# EAGLE design RasPi-BplusHAT (EAGLE 8.6.3)
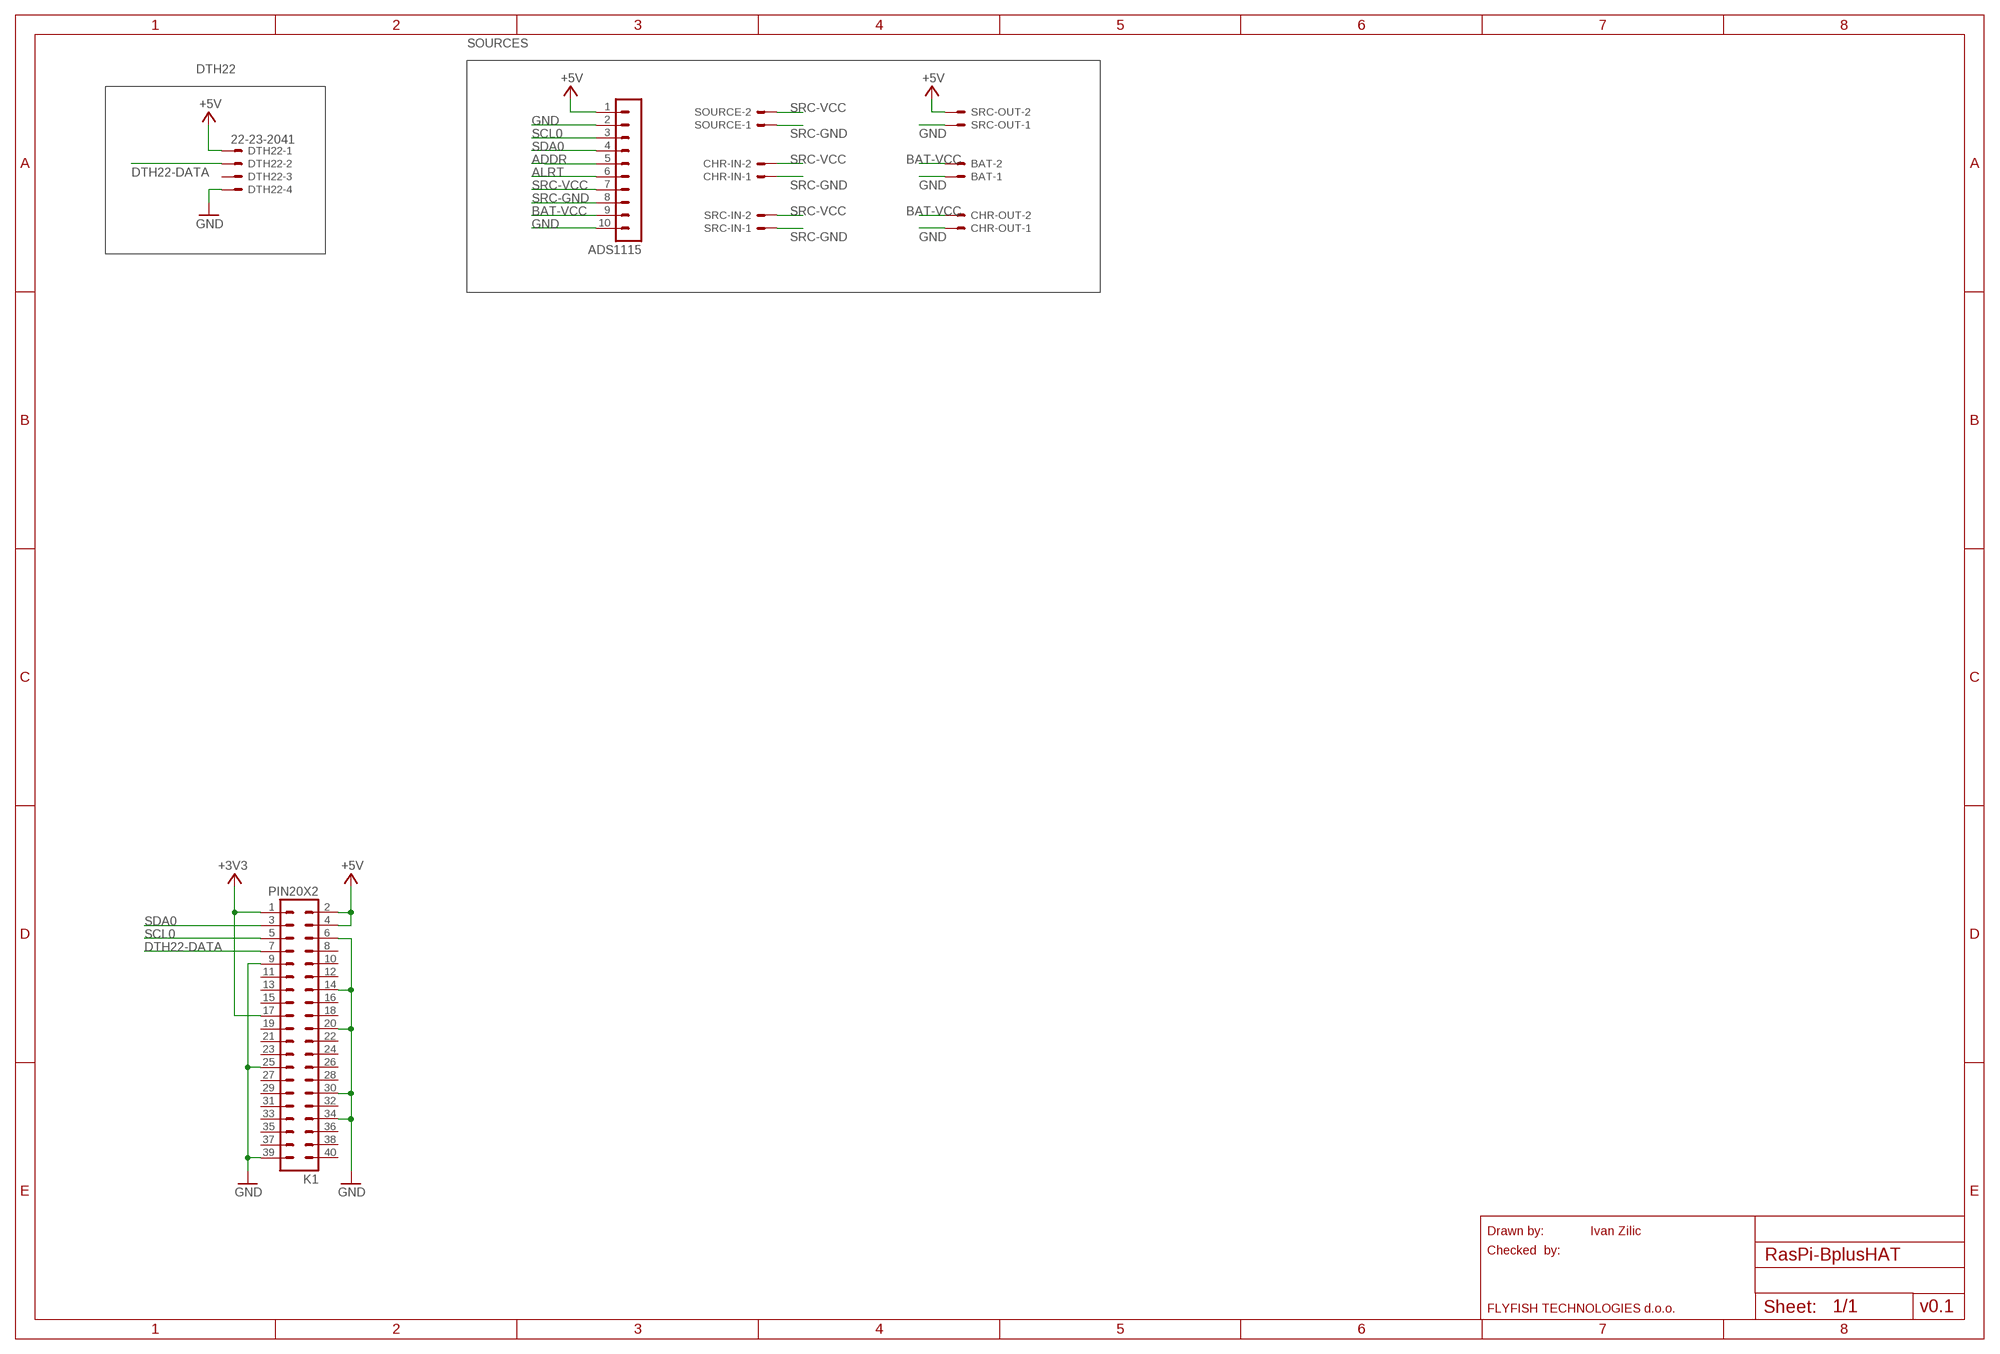
[diagram p0: schematic, sheet 1]

## Parts
ADS1115  MA10-1  [MA10-1]
BAT  22-23-2021  [22-23-2021]
CHR-IN  22-23-2021  [22-23-2021]
CHR-OUT  22-23-2021  [22-23-2021]
DTH22  22-23-2041  [22-23-2041]
K1  PIN20X2  [PIN_20X2]
SOURCE  22-23-2021  [22-23-2021]
SRC-IN  22-23-2021  [22-23-2021]
SRC-OUT  22-23-2021  [22-23-2021]

## Nets
+3V3: K1.1 K1.17
+5V: ADS1115.1 DTH22.1 K1.2 K1.4 SRC-OUT.2
ADDR: ADS1115.5
ALRT: ADS1115.6
BAT-VCC: ADS1115.9 BAT.2 CHR-OUT.2
DTH22-DATA: DTH22.2 K1.7
GND: ADS1115.2 ADS1115.10 BAT.1 CHR-OUT.1 DTH22.4 K1.6 K1.9 K1.14 K1.20 K1.25 K1.30 K1.34 K1.39 SRC-OUT.1
SCL0: ADS1115.3 K1.5
SDA0: ADS1115.4 K1.3
SRC-GND: ADS1115.8 CHR-IN.1 SOURCE.1 SRC-IN.1
SRC-VCC: ADS1115.7 CHR-IN.2 SOURCE.2 SRC-IN.2
Unconnected: DTH22.3 K1.8 K1.10 K1.11 K1.12 K1.13 K1.15 K1.16 K1.18 K1.19 K1.21 K1.22 K1.23 K1.24 K1.26 K1.27 K1.28 K1.29 K1.31 K1.32 K1.33 K1.35 K1.36 K1.37 K1.38 K1.40

## Notes on the sheet
- SOURCES
- DTH22
- Drawn by: | Ivan Zilic
- Checked  by:
- FLYFISH TECHNOLOGIES d.o.o. | v0.1

## Library data of the parts
ADS1115 = con-lstb:MA10-1: PIN HEADER; OC_FARNELL: unknown; OC_NEWARK: unknown
BAT CHR-IN CHR-OUT SOURCE SRC-IN SRC-OUT = con-molex:22-23-2021: .100" (2.54mm) Center Header - 2 Pin; MF: MOLEX; MPN: 22-23-2021; OC_FARNELL: 1462926; OC_NEWARK: 25C3832
DTH22 = con-molex:22-23-2041: .100" (2.54mm) Center Header - 4 Pin; MF: MOLEX; MPN: 22-23-2041; OC_FARNELL: 1462920; OC_NEWARK: 38C0355
K1 = FLYFISH:PIN20X2

## Board
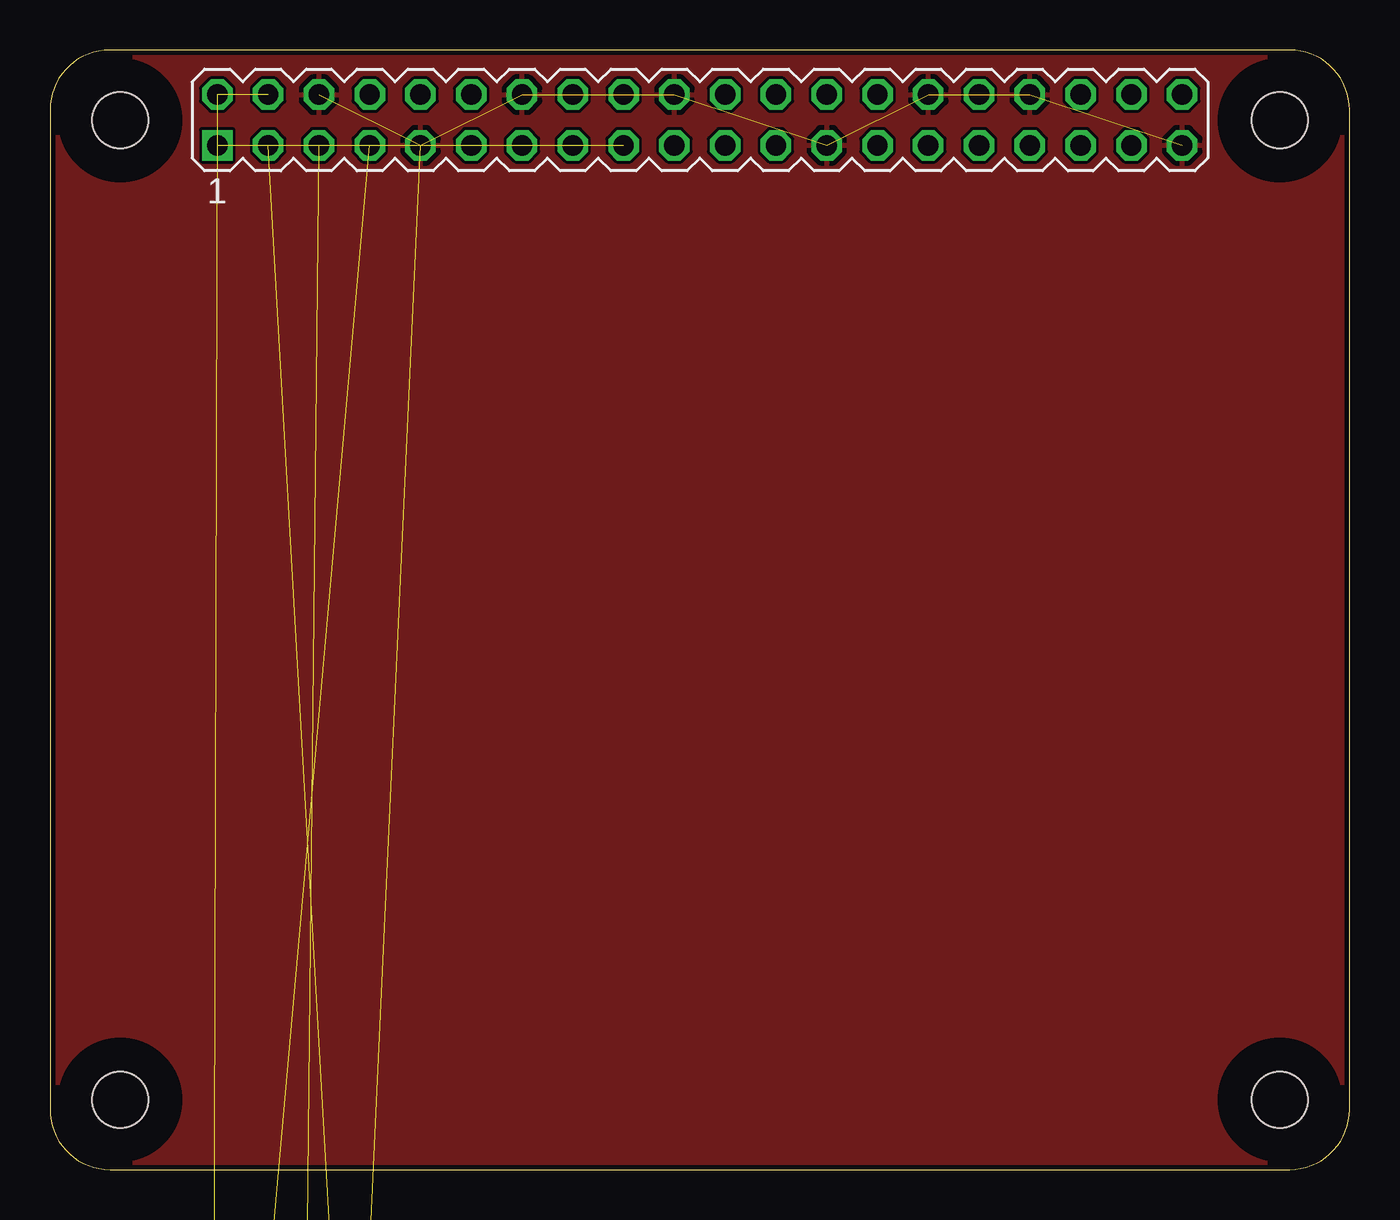
[diagram p1: board, top side]
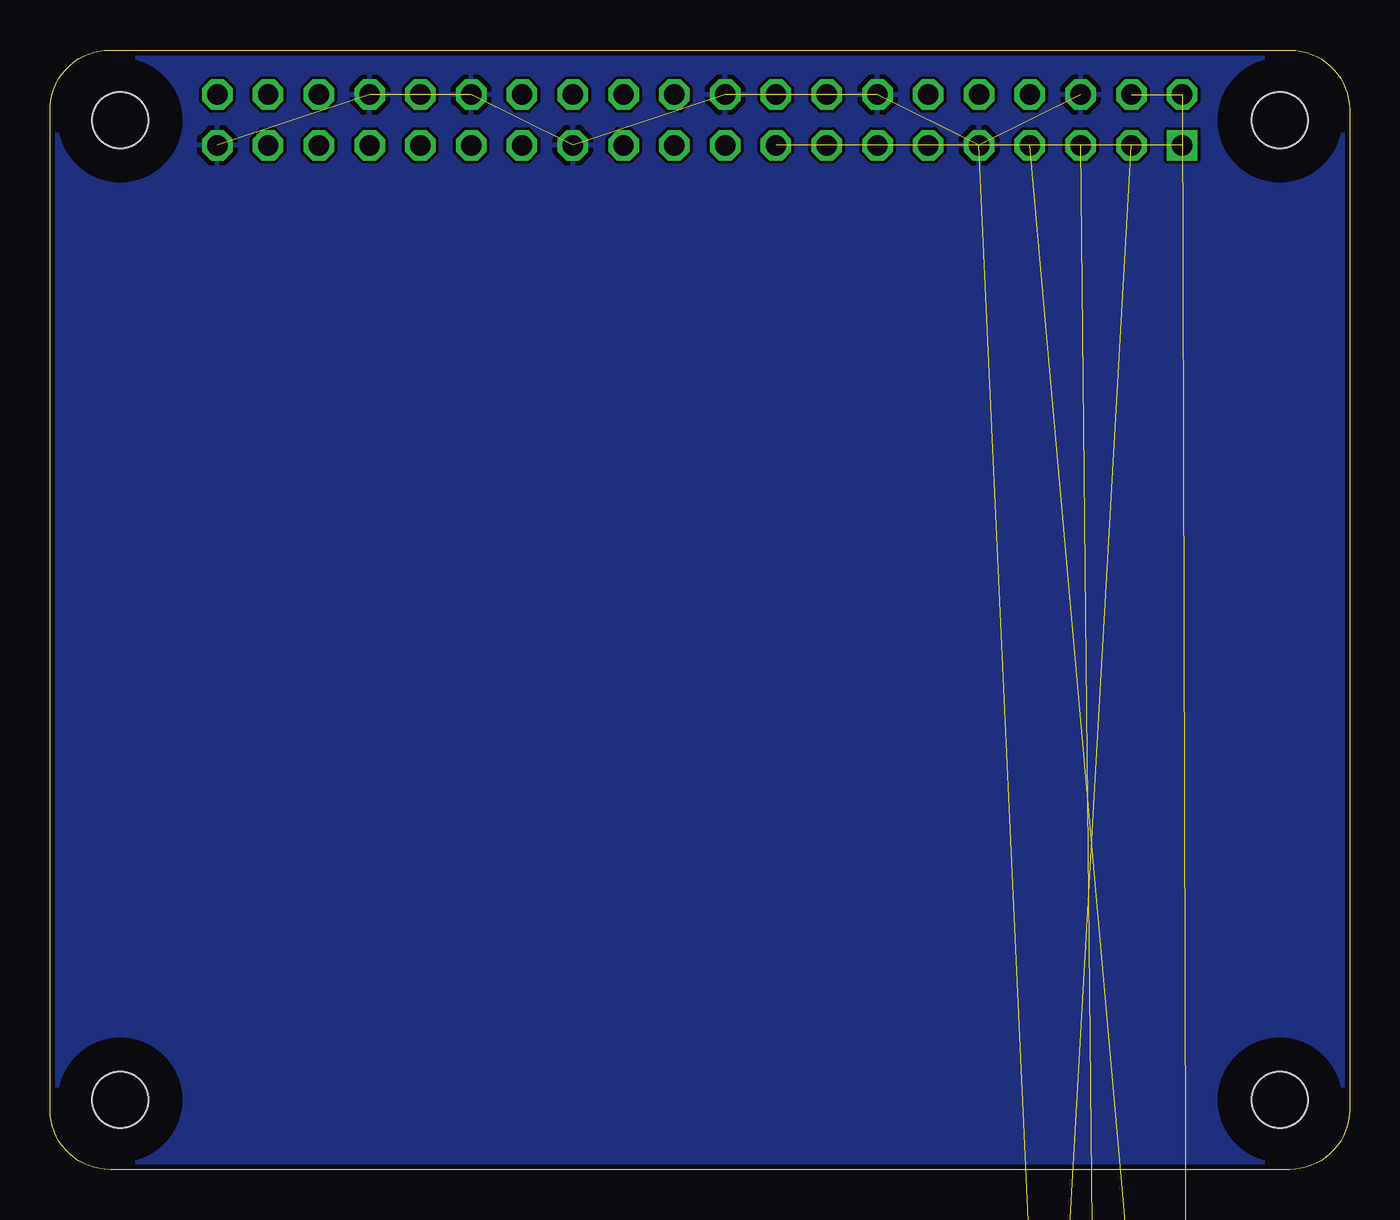
[diagram p2: board, bottom side, seen from below]

Size 65 x 56 mm. Coordinates in mm from the lower left corner, seen from the top.
Outline: 0,3 arc90 3,0 62,0 arc90 65,3 65,53 arc90 62,56 3,56 arc90 0,53 0,3
Copper layers (1*16): Top 0.035mm / dielectric 1.5mm / Bottom 0.035mm
Design rules "ITEADstudio_DRC": minimum track width 6mil, minimum drill 12mil, track to track 6mil, track to pad 6mil, pad to pad 6mil, via to via 6mil, smd to smd 0mil, copper to edge 10mil, drill to drill 10mil, minimum pad ring 10mil, minimum via ring 6mil, stop-mask expansion 2mil, vias tented up to drill 100mil, thermal gap 10mil
Holes 2.8 mm at 3.5,3.5 3.5,52.5 61.5,52.5 61.5,3.5
tRestrict: area 1.9,51 to 5,54; area 60,51 to 63,54; area 60,1.9 to 63,5; area 1.9,1.9 to 5,5
bRestrict: area 1.9,1.9 to 5,5; area 1.9,51 to 5,54; area 60,1.9 to 63,5; area 60,51 to 63,54

### Footprints (pad centres in the part's own frame; a part is rotated, then mirrored left to right if it is on the bottom)
MA10-1 = drill 1.016 long: 1 -11.43,0; 2 -8.89,0; 3 -6.35,0; 4 -3.81,0; 5 -1.27,0; 6 1.27,0; 7 3.81,0; 8 6.35,0; 9 8.89,0; 10 11.43,0
22-23-2021 = drill 1 long: 1 -1.27,0; 2 1.27,0
22-23-2041 = drill 1 long: 1 -3.81,0; 2 -1.27,0; 3 1.27,0; 4 3.81,0
PIN_20X2 = drill 1.016 square: 1 -24.13,-1.27 | drill 1.016 octagon: 2 -24.13,1.27; 3 -21.59,-1.27; 4 -21.59,1.27; 5 -19.05,-1.27; 6 -19.05,1.27; 7 -16.51,-1.27; 8 -16.51,1.27; 9 -13.97,-1.27; 10 -13.97,1.27; 11 -11.43,-1.27; 12 -11.43,1.27; 13 -8.89,-1.27; 14 -8.89,1.27; 15 -6.35,-1.27; 16 -6.35,1.27; 17 -3.81,-1.27; 18 -3.81,1.27; 19 -1.27,-1.27; 20 -1.27,1.27; 21 1.27,-1.27; 22 1.27,1.27; 23 3.81,-1.27; 24 3.81,1.27; 25 6.35,-1.27; 26 6.35,1.27; 27 8.89,-1.27; 28 8.89,1.27; 29 11.43,-1.27; 30 11.43,1.27; 31 13.97,-1.27; 32 13.97,1.27; 33 16.51,-1.27; 34 16.51,1.27; 35 19.05,-1.27; 36 19.05,1.27; 37 21.59,-1.27; 38 21.59,1.27; 39 24.13,-1.27; 40 24.13,1.27

### Placement (x,y rotation side)
ADS1115  19,-24 0 top  (outside the outline)
BAT  9,-40 0 top  (outside the outline)
CHR-IN  9,-104 0 top  (outside the outline)
CHR-OUT  9,-72 0 top  (outside the outline)
DTH22  12,-8 0 top  (outside the outline)
K1  32.5,52.5 0 top
SOURCE  9,-56 0 top  (outside the outline)
SRC-IN  9,-120 0 top  (outside the outline)
SRC-OUT  9,-88 0 top  (outside the outline)

### Tracks (layer width: path | path; a pad name or v marks a point on that pad's centre or on a via)
+3V3  (1 unrouted)
+5V  (4 unrouted)
BAT-VCC  (2 unrouted)
DTH22-DATA  (1 unrouted)
GND  (13 unrouted)
  pour Bottom: 0,3 arc90 3,0 62,0 arc90 65,3 65,53 arc90 62,56 3,56 arc90 0,53
  pour Top: 0,3 arc90 3,0 62,0 arc90 65,3 65,53 arc90 62,56 3,56 arc90 0,53
SCL0  (1 unrouted)
SDA0  (1 unrouted)
SRC-GND  (3 unrouted)
SRC-VCC  (3 unrouted)